# Altium project HomeButtons_mini.PrjPcb
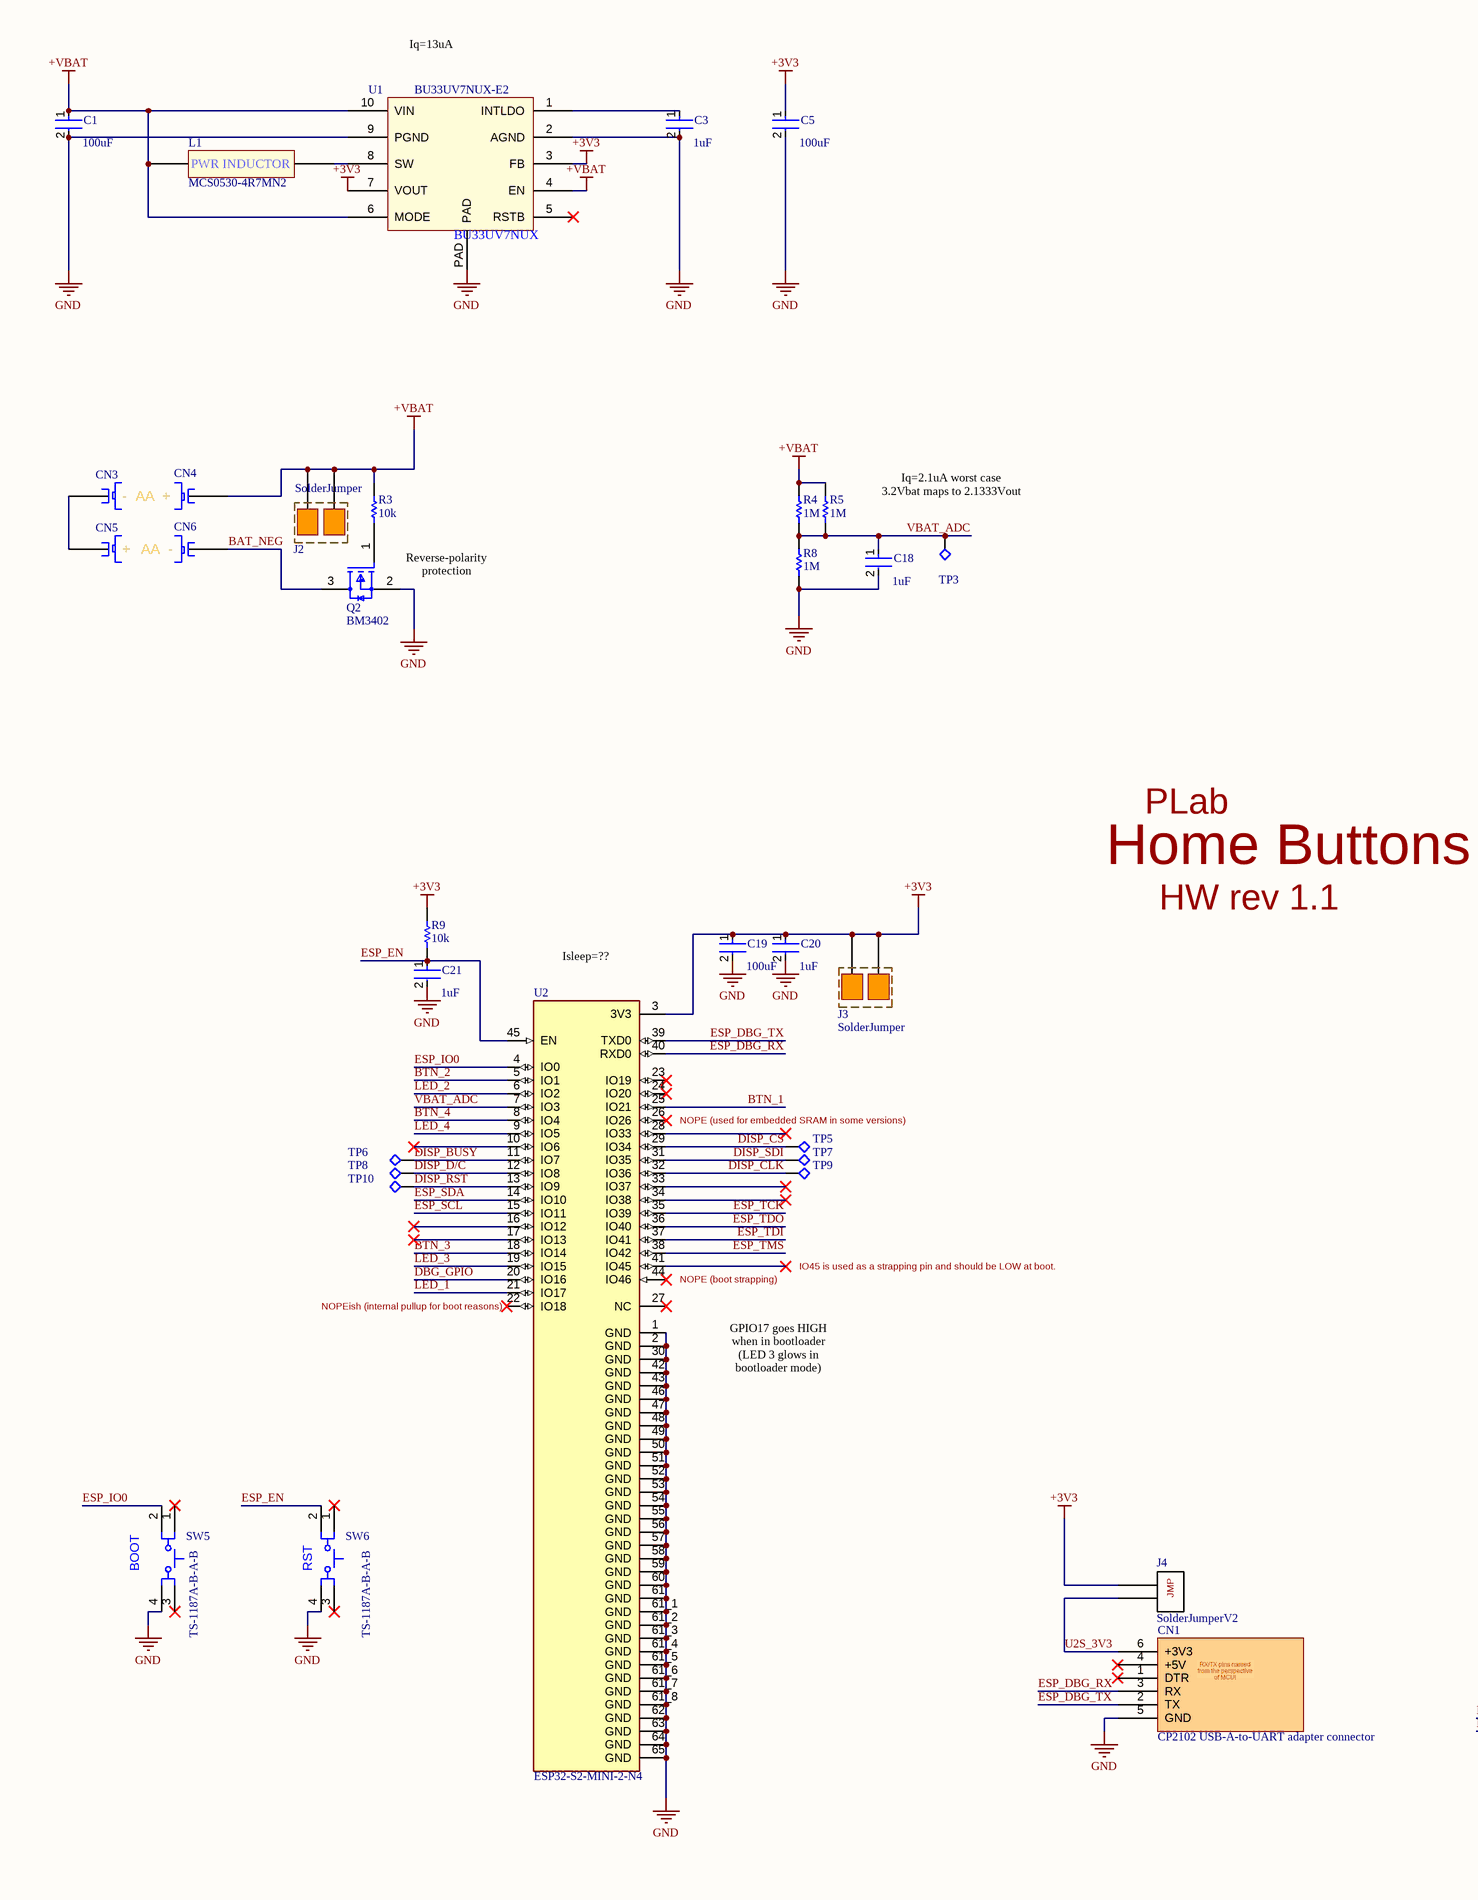
[diagram p0: HB_mini_schematic.SchDoc, left]
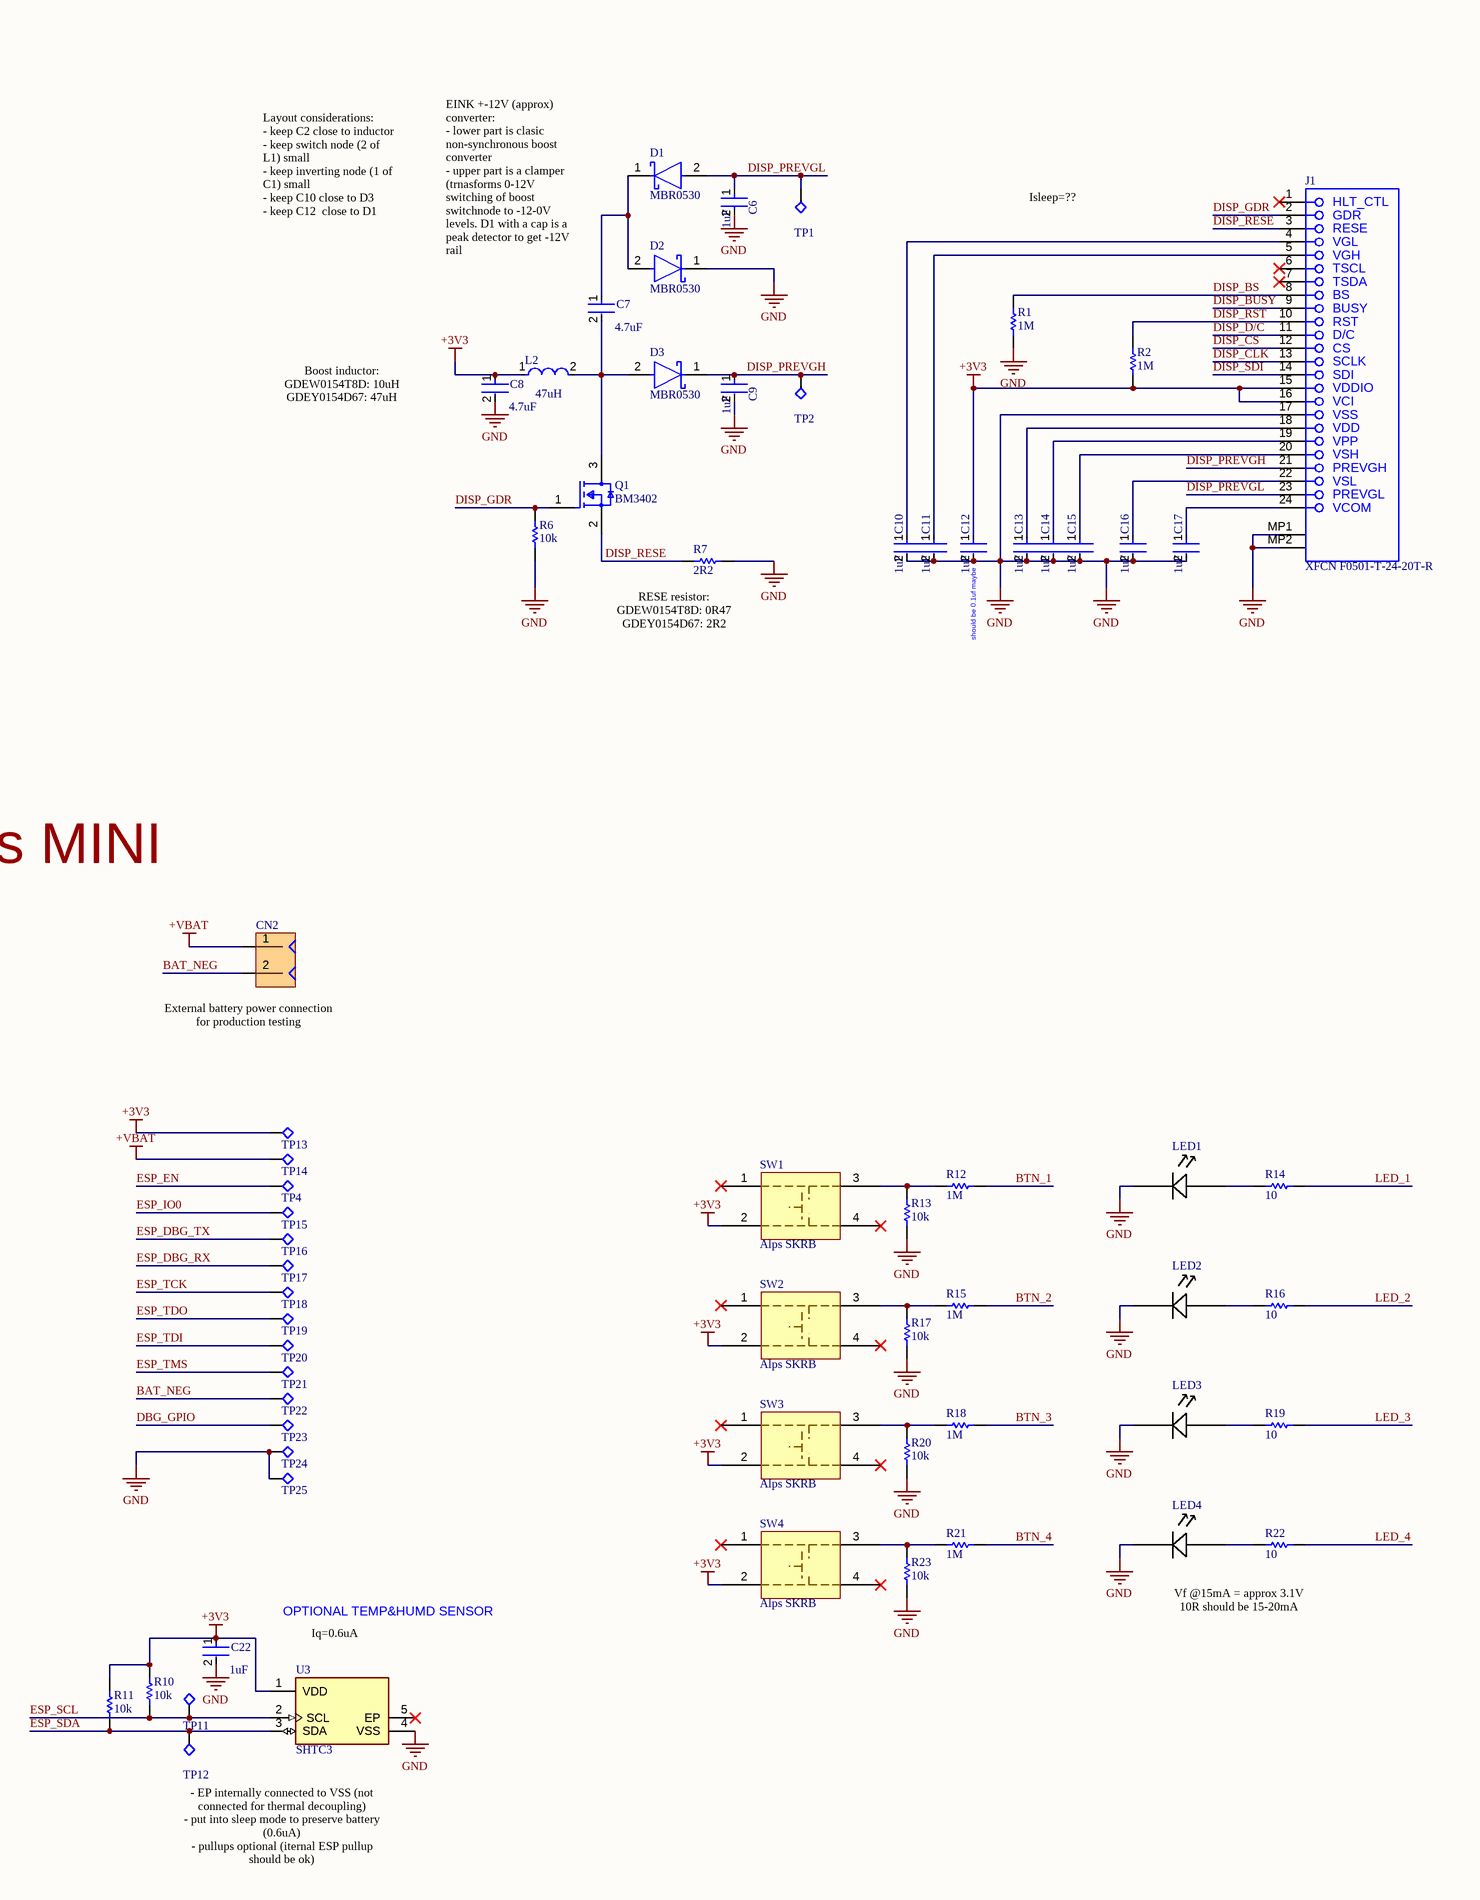
[diagram p1: HB_mini_schematic.SchDoc, right]
1 sheet, 98 parts. Net scope: global (net labels, ports and power ports of the same name join across sheets).
Board files: HB_mini_alt_PCB.PcbDoc, HB_mini_panel.PcbDoc

## Sheet HB_mini_schematic.SchDoc
size 594 x 420 mm; SheetNumber: 1; SheetTotal: 1

### Parts
C1  Capacitance: 100uF  [FP-CL31-IPC_B]  (hidden comment: CL31A107MQHNNNE)
C3  value 1uF  [FP-CL10B105KO8NNNC-IPC_B]  (hidden comment: CL10A105KB8NNNC)
C5  Capacitance: 100uF  [FP-CL31-IPC_B]  (hidden comment: CL31A107MQHNNNE)
C6  value 1uF  [FP-CL10B105KO8NNNC-IPC_B]  (hidden comment: CL10A105KB8NNNC)
C7  Capacitance: 4.7uF  [FP-CL21-IPC_A]  (hidden comment: CL21A475KAQNNNE)
C8  Capacitance: 4.7uF  [FP-CL21-IPC_A]  (hidden comment: CL21A475KAQNNNE)
C9  value 1uF  [FP-CL10B105KO8NNNC-IPC_B]  (hidden comment: CL10A105KB8NNNC)
C10  value 1uF  [FP-CL10B105KO8NNNC-IPC_B]  (hidden comment: CL10A105KB8NNNC)
C11  value 1uF  [FP-CL10B105KO8NNNC-IPC_B]  (hidden comment: CL10A105KB8NNNC)
C12  value 1uF  [FP-CL10B105KO8NNNC-IPC_B]  (hidden comment: CL10A105KB8NNNC)
C13  value 1uF  [FP-CL10B105KO8NNNC-IPC_B]  (hidden comment: CL10A105KB8NNNC)
C14  value 1uF  [FP-CL10B105KO8NNNC-IPC_B]  (hidden comment: CL10A105KB8NNNC)
C15  value 1uF  [FP-CL10B105KO8NNNC-IPC_B]  (hidden comment: CL10A105KB8NNNC)
C16  value 1uF  [FP-CL10B105KO8NNNC-IPC_B]  (hidden comment: CL10A105KB8NNNC)
C17  value 1uF  [FP-CL10B105KO8NNNC-IPC_B]  (hidden comment: CL10A105KB8NNNC)
C18  value 1uF  [FP-CL10B105KO8NNNC-IPC_B]  (hidden comment: CL10A105KB8NNNC)
C19  Capacitance: 100uF  [FP-CL31-IPC_B]  (hidden comment: CL31A107MQHNNNE)
C20  value 1uF  [FP-CL10B105KO8NNNC-IPC_B]  (hidden comment: CL10A105KB8NNNC)
C21  value 1uF  [FP-CL10B105KO8NNNC-IPC_B]  (hidden comment: CL10A105KB8NNNC)
C22  value 1uF  [FP-CL10B105KO8NNNC-IPC_B]  (hidden comment: CL10A105KB8NNNC)
CN1  CP2102 USB-A-to-UART adapter connector  [CP2102 USB-A-to-UART adapter connector]
CN2  2 pin pogo connection  [2x2 POGO power landing pad]  (value not drawn)
CN3  Battery contact  [MYOUNG MY-AA-04]  (value not drawn)
CN4  Battery contact  [MYOUNG MY-AA-04]  (value not drawn)
CN5  Battery contact  [MYOUNG MY-AA-04]  (value not drawn)
CN6  Battery contact  [MYOUNG MY-AA-04]  (value not drawn)
D1  MBR0530  [FP-425-04-IPC_B]
D2  MBR0530  [FP-425-04-IPC_B]
D3  MBR0530  [FP-425-04-IPC_B]
J1  XFCN F0501-T-24-20T-R  [XFCN F0501-T-24-20T-R]
J2  SolderJumper  [AislerRule_SolderJumper_1mm]
J3  SolderJumper  [AislerRule_SolderJumper_1mm]
J4  SolderJumperV2  [AislerRule_SolderJumper_1mm]
L1  MCS0530-4R7MN2  [MCS0530-4R7MN2 - NEW]
L2  Inductance: 47uH  [FP-CB3225-IPC_B]  (hidden comment: CBC3225T470KR)
LED1  EKINGLUX E6CC1206CWAY1UDA  [EKINGLUX E6CC1206CWAY1UDA]  (value not drawn)
LED2  EKINGLUX E6CC1206CWAY1UDA  [EKINGLUX E6CC1206CWAY1UDA]  (value not drawn)
LED3  EKINGLUX E6CC1206CWAY1UDA  [EKINGLUX E6CC1206CWAY1UDA]  (value not drawn)
LED4  EKINGLUX E6CC1206CWAY1UDA  [EKINGLUX E6CC1206CWAY1UDA]  (value not drawn)
Q1  BM3402  [FP-SOT23-IPC_B]
Q2  BM3402  [FP-SOT23-IPC_B]
R1  value 1M  [RESC1608X55X30NL15T15]  (hidden comment: 0603WAF1004T5E)
R2  value 1M  [RESC1608X55X30NL15T15]  (hidden comment: 0603WAF1004T5E)
R3  value 10k  [RESC1608X55X30NL15T15]  (hidden comment: 0603WAF1002T5E)
R4  value 1M  [RESC1608X55X30NL15T15]  (hidden comment: 0603WAF1004T5E)
R5  value 1M  [RESC1608X55X30NL15T15]  (hidden comment: 0603WAF1004T5E)
R6  value 10k  [RESC1608X55X30NL15T15]  (hidden comment: 0603WAF1002T5E)
R7  value 2R2  [RESC1608X55X30ML15T15]  (hidden comment: 0603WAF220KT5E)
R8  value 1M  [RESC1608X55X30NL15T15]  (hidden comment: 0603WAF1004T5E)
R9  value 10k  [RESC1608X55X30NL15T15]  (hidden comment: 0603WAF1002T5E)
R10  value 10k  [RESC1608X55X30NL15T15]  (hidden comment: 0603WAF1002T5E)
R11  value 10k  [RESC1608X55X30NL15T15]  (hidden comment: 0603WAF1002T5E)
R12  value 1M  [RESC1608X55X30NL15T15]  (hidden comment: 0603WAF1004T5E)
R13  value 10k  [RESC1608X55X30NL15T15]  (hidden comment: 0603WAF1002T5E)
R14  value 10  [RESC1608X55X30NL15T15]  (hidden comment: 0603WAF100JT5E)
R15  value 1M  [RESC1608X55X30NL15T15]  (hidden comment: 0603WAF1004T5E)
R16  value 10  [RESC1608X55X30NL15T15]  (hidden comment: 0603WAF100JT5E)
R17  value 10k  [RESC1608X55X30NL15T15]  (hidden comment: 0603WAF1002T5E)
R18  value 1M  [RESC1608X55X30NL15T15]  (hidden comment: 0603WAF1004T5E)
R19  value 10  [RESC1608X55X30NL15T15]  (hidden comment: 0603WAF100JT5E)
R20  value 10k  [RESC1608X55X30NL15T15]  (hidden comment: 0603WAF1002T5E)
R21  value 1M  [RESC1608X55X30NL15T15]  (hidden comment: 0603WAF1004T5E)
R22  value 10  [RESC1608X55X30NL15T15]  (hidden comment: 0603WAF100JT5E)
R23  value 10k  [RESC1608X55X30NL15T15]  (hidden comment: 0603WAF1002T5E)
SW1  Alps SKRB  [Alps SKRB]
SW2  Alps SKRB  [Alps SKRB]
SW3  Alps SKRB  [Alps SKRB]
SW4  Alps SKRB  [Alps SKRB]
SW5  TS-1187A-B-A-B  [ESWI-TL3342F160QG_V]
SW6  TS-1187A-B-A-B  [ESWI-TL3342F160QG_V]
TP1  test point 1.5mm  [TP1_FULL]  (value not drawn)
TP2  test point 1.5mm  [TP1_FULL]  (value not drawn)
TP3  test point 1.5mm  [TP1_FULL]  (value not drawn)
TP4  test point 1.5mm  [TP1_FULL]  (value not drawn)
TP5  test point 1.5mm  [TP1_FULL]  (value not drawn)
TP6  test point 1.5mm  [TP1_FULL]  (value not drawn)
TP7  test point 1.5mm  [TP1_FULL]  (value not drawn)
TP8  test point 1.5mm  [TP1_FULL]  (value not drawn)
TP9  test point 1.5mm  [TP1_FULL]  (value not drawn)
TP10  test point 1.5mm  [TP1_FULL]  (value not drawn)
TP11  test point 1.5mm  [TP1_FULL]  (value not drawn)
TP12  test point 1.5mm  [TP1_FULL]  (value not drawn)
TP13  test point 1.5mm  [TP1_FULL]  (value not drawn)
TP14  test point 1.5mm  [TP1_FULL]  (value not drawn)
TP15  test point 1.5mm  [TP1_FULL]  (value not drawn)
TP16  test point 1.5mm  [TP1_FULL]  (value not drawn)
TP17  test point 1.5mm  [TP1_FULL]  (value not drawn)
TP18  test point 1.5mm  [TP1_FULL]  (value not drawn)
TP19  test point 1.5mm  [TP1_FULL]  (value not drawn)
TP20  test point 1.5mm  [TP1_FULL]  (value not drawn)
TP21  test point 1.5mm  [TP1_FULL]  (value not drawn)
TP22  test point 1.5mm  [TP1_FULL]  (value not drawn)
TP23  test point 1.5mm  [TP1_FULL]  (value not drawn)
TP24  test point 1.5mm  [TP1_FULL]  (value not drawn)
TP25  test point 1.5mm  [TP1_FULL]  (value not drawn)
U1  BU33UV7NUX-E2  [VSON010X3020]
U2  ESP32-S2-MINI-2-N4  [XCVR_ESP32-S2-MINI-1]
U3  SHTC3  [FP-SHTC3-MFG]

### Nets
+3V3: C5.1 C8.1 C12.1 C19.1 C20.1 C22.1 J1.15 J1.16 J3.1 J3.2 J4.1(P1) L2.1 R2.1 R9.2 R10.2 R11.2 SW1.2 SW2.2 SW3.2 SW4.2 TP13.1 U1.3(FB) U1.7(VOUT) U2.3(3V3) U3.1(VDD)
+VBAT: C1.1 CN2.1 CN4.1 J2.1 J2.2 L1.1 R3.2 R4.2 R5.2 TP14.1 U1.4(EN) U1.6(MODE) U1.10(VIN)
GND: C1.2 C3.2 C5.2 C6.2 C8.2 C9.2 C10.2 C11.2 C12.2 C13.2 C14.2 C15.2 C16.2 C17.2 C18.2 C19.2 C20.2 C21.2 C22.2 CN1.5(GND) D2.1(C) J1.17 J1.MP1 J1.MP2 LED1.2(NEG) LED2.2(NEG) LED3.2(NEG) LED4.2(NEG) Q2.2(S) R1.1 R6.1 R7.2 R8.1 R13.1 R17.1 R20.1 R23.1 SW5.4 SW6.4 TP24.1 TP25.1 U1.2(AGND) U1.9(PGND) U1.PAD U2.1(GND) U2.2(GND) U2.30(GND) U2.42(GND) U2.43(GND) U2.46(GND) U2.47(GND) U2.48(GND) U2.49(GND) U2.50(GND) U2.51(GND) U2.52(GND) U2.53(GND) U2.54(GND) U2.55(GND) U2.56(GND) U2.57(GND) U2.58(GND) U2.59(GND) U2.60(GND) U2.61(GND) U2.61_1(GND) U2.61_2(GND) U2.61_3(GND) U2.61_4(GND) U2.61_5(GND) U2.61_6(GND) U2.61_7(GND) U2.61_8(GND) U2.62(GND) U2.63(GND) U2.64(GND) U2.65(GND) U3.4(VSS)
BAT_NEG: CN2.2 CN6.1 Q2.3(D) TP22.1
BTN_1: R12.2 U2.25(IO21)
BTN_2: R15.2 U2.5(IO1)
BTN_3: R18.2 U2.18(IO14)
BTN_4: R21.2 U2.8(IO4)
DBG_GPIO: TP23.1 U2.20(IO16)
DISP_BS: J1.8 R1.2
DISP_BUSY: J1.9 TP6.1 U2.11(IO7)
DISP_CLK: J1.13 TP9.1 U2.32(IO36)
DISP_CS: J1.12 TP5.1 U2.29(IO34)
DISP_D/C: J1.11 TP8.1 U2.12(IO8)
DISP_GDR: J1.2 Q1.1(G) R6.2
DISP_PREVGH: C9.1 D3.1(C) J1.21 TP2.1
DISP_PREVGL: C6.1 D1.2(A) J1.23 TP1.1
DISP_RESE: J1.3 Q1.2(S) R7.1
DISP_RST: J1.10 R2.2 TP10.1 U2.13(IO9)
DISP_SDI: J1.14 TP7.1 U2.31(IO35)
ESP_DBG_RX: CN1.3(RX) TP17.1 U2.40(RXD0)
ESP_DBG_TX: CN1.2(TX) TP16.1 U2.39(TXD0)
ESP_EN: C21.1 R9.1 SW6.2 TP4.1 U2.45(EN)
ESP_IO0: SW5.2 TP15.1 U2.4(IO0)
ESP_SCL: R10.1 TP11.1 U2.15(IO11) U3.2(SCL)
ESP_SDA: R11.1 TP12.1 U2.14(IO10) U3.3(SDA)
ESP_TCK: TP18.1 U2.35(IO39)
ESP_TDI: TP20.1 U2.37(IO41)
ESP_TDO: TP19.1 U2.36(IO40)
ESP_TMS: TP21.1 U2.38(IO42)
LED_1: R14.1 U2.21(IO17)
LED_2: R16.1 U2.6(IO2)
LED_3: R19.1 U2.19(IO15)
LED_4: R22.1 U2.9(IO5)
U2S_3V3: CN1.6(+3V3) J4.2
VBAT_ADC: C18.1 R4.1 R5.1 R8.2 TP3.1 U2.7(IO3)
NetC3_1: C3.1 U1.1(INTLDO)
NetC7_1: C7.1 D1.1(C) D2.2(A)
NetC7_2: C7.2 D3.2(A) L2.2 Q1.3(D)
NetC10_1: C10.1 J1.4
NetC11_1: C11.1 J1.5
NetC13_1: C13.1 J1.18
NetC14_1: C14.1 J1.19
NetC15_1: C15.1 J1.20
NetC16_1: C16.1 J1.22
NetC17_1: C17.1 J1.24
NetCN3_1: CN3.1 CN5.1
NetL1_2: L1.2 U1.8(SW)
NetLED1_1: LED1.1(POS) R14.2
NetLED2_1: LED2.1(POS) R16.2
NetLED3_1: LED3.1(POS) R19.2
NetLED4_1: LED4.1(POS) R22.2
NetQ2_1: Q2.1(G) R3.1
NetR12_1: R12.1 R13.2 SW1.3
NetR15_1: R15.1 R17.2 SW2.3
NetR18_1: R18.1 R20.2 SW3.3
NetR21_1: R21.1 R23.2 SW4.3

Not connected (* = marked no-connect by the designer): CN1 1(DTR)* 4(+5V)*; J1 1* 6* 7*; SW1 1* 4*; SW2 1* 4*; SW3 1* 4*; SW4 1* 4*; SW5 1* 3*; SW6 1* 3*; U1 5(RSTB)*; U2 10(IO6)* 16(IO12)* 17(IO13)* 22(IO18)* 23(IO19)* 24(IO20)* 26(IO26)* 27(NC)* 28(IO33)* 33(IO37)* 34(IO38)* 41(IO45)* 44(IO46)*; U3 5(EP)*

### Notes on the sheet
- (near U1) Iq=13uA
- Isleep=??
- Layout considerations:
  - keep C2 close to inductor
  - keep switch node (2 of L1) small
  - keep inverting node (1 of C1) small
  - keep C10 close to D3
  - keep C12  close to D1
- EINK +-12V (approx) converter:
  - lower part is clasic non-synchronous boost converter
  - upper part is a clamper (trnasforms 0-12V switching of boost switchnode to -12-0V levels. D1 with a cap is a peak detector to get -12V rail
- Boost inductor:
  GDEW0154T8D: 10uH
  GDEY0154D67: 47uH
- (near CN5) +
- (near CN3) -
- AA
- (near CN4) +
- (near CN6) -
- Iq=2.1uA worst case
  3.2Vbat maps to 2.1333Vout
- (near Q2) Reverse-polarity protection
- (near R7) RESE resistor:
  GDEW0154T8D: 0R47
  GDEY0154D67: 2R2
- (near C12) should be 0.1uf maybe
- PLab
- Home Buttons MINI
- HW rev 1.1
- (near U2) Isleep=??
- (near CN2) External battery power connection for production testing
- NOPE (used for embedded SRAM in some versions)
- (near U2) NOPE (boot strapping)
- IO45 is used as a strapping pin and should be LOW at boot.
- (near U2) NOPEish (internal pullup for boot reasons)
- GPIO17 goes HIGH when in bootloader (LED 3 glows in bootloader mode)
- (near SW5) BOOT
- (near SW6) RST
- OPTIONAL TEMP&HUMD SENSOR
- (near U3) Iq=0.6uA
- Vf @15mA = approx 3.1V
  10R should be 15-20mA
- - EP internally connected to VSS (not connected for thermal decoupling)
  - put into sleep mode to preserve battery (0.6uA)
  - pullups optional (iternal ESP pullup should be ok)
- DWG NO:
- REV:
- THIS DOCUMENT AND THE DATA DISCLOSED HEREIN OR
- HEREWITH IS THE PROPERTY OF ALTIUM LIMITED AND MAY
- BE FREELY DISTRIBUTED IN WHOLE. NO RIGHTS ARE
- RESERVED OR EXPRESS OR IMPLIED WARANTEE GIVEN.
- REVISION
- DESCRIPTION
- DATE
- APPROVED
- ENG:
- APPROVALS
- PROJECT
- DSN:
- CHK:
- REFERENCE DOCUMENTS
- PROJECT REVISION:
- TITLE
- DOCUMENT REVISION:
- DESIGN ITEM:
- BOM:
- FAB DWG:
- PCB DWG:
- ASSY DWG:
- SCALE:
- A2
- SIZE
- CAGE CODE
- FILE NAME
- DWG NO.
- SHEET
- OF
- REV
- (in symbol BU33UV7NUX-E2) BU33UV7NUX
- (in symbol CP2102 USB-A-to-UART adapter connector) RX/TX pins named from the perspective of MCU!
- (in symbol PowerInductor) PWR INDUCTOR
- (in symbol SolderJumperV2) JMP
- (in symbol XFCN F0501-T-24-20T-R) HLT_CTL; GDR; RESE; VGL; VGH; TSCL; TSDA; BS; BUSY; RST; D/C; CS; SCLK; SDI; VDDIO; VCI; VSS; VDD; VPP; VSH; PREVGH; VSL; PREVGL; VCOM

### Library data of the parts
C1 C5 C19 = CMP-13271-002604-1: Cap Ceramic 100uF 6.3V X5R ±10% SMD 1206; Package Quantity: 1; Radiation Hardening: No; Thickness: 0.071inch; Case Code (Metric): 3216; Height: 1.6mm; Min Operating Temperature: -55°C; Width: 0.063inch; Mount: Surface Mount; Packaging: Tape and Reel; Depth: 1.6mm; Max Operating Temperature: 85°C; Dielectric: X5R; Case/Package: 1206; Lead Free: Lead Free; Tolerance: 10%; Case Code (Imperial): 1206; Length: 3.2mm; Voltage Rating (DC): 6.3V; Voltage Rating: 6.3V; JLCPCB part #: C15008
C3 C6 C9-C18 C20-C22 = CMP-2000-06093-2: CAP CER 1UF 50V X5R 0603; Manufacturer: Samsung Electro-Mechanics America, Inc; Manufacturer Part Number: CL10B105KO8NNNC; Temperature Coefficient: 15%; Material: Ceramic; Tolerance: 10%; Voltage Rating: 50V; Automotive: No; ComponentLink2Description: Datasheet; Device Class L3: Ceramic Capacitors; Capacitance: 1uF; Temperature Characteristic: X5R; Temperature Range High: +125°C; Digikey Description: CAP CER 1UF 16V X7R 0603; Device Class L2: Capacitors; Octopart: https://octopart.com/cl10b105ko8nnnc-samsung-19018973; ComponentLink2URL: http://www.samsungsem.com/global/front/downloadcms.do?path=%2F%2Fglobal%2F%2Fsupport%2F%2Fproduct-search%2F%2Fmlcc%2F%2F__icsFiles%2F%2Fafieldfile%2F%2F2019%2F%2F06%2F%2F18&fileName=CL10B105KO8NNNC-19.pdf; Lead Free: Yes; Height: 0.9mm; Package: CL10B105KO8NNNC; Temperature Range Low: -55°C; Device Class L1: Passive Components; RoHS: TRUE; Temperature: -55°C to +125°C; Category: Cap; Ipc Land Pattern Name: CAPC16080X80; JLCPCB part #: C15849
C7 C8 = CMP-13271-002624-1: CL21 Series 0805 4.7uF 25V ±10% Tolerance X5R Multilayer Ceramic Chip Capacitor; Case Code (Imperial): 0805; Thickness: 0.055inch; Mount: Surface Mount; Case Code (Metric): 2012; Depth: 1.25mm; Lead Free: Lead Free; Case/Package: 0805; Voltage Rating: 25V; Package Quantity: 1; Width: 0.049inch; Radiation Hardening: No; Voltage Rating (DC): 25V; Length: 2mm; Dielectric: X5R; Height: 1.25mm; Packaging: Tape and Reel; Tolerance: 10%; Min Operating Temperature: -55°C; Max Operating Temperature: 85°C; JLCPCB part #: C1779
CN3-CN6 = Battery contact: Battery contact with selectable footprint; JLCPCB part #: C2979179
D1-D3 = CMP-2000-05113-2: DIODE SCHOTTKY 30V 500MA SOD123; Polarity: Standard; Max Reverse Leakage Current: 130uA; Forward Voltage: 430mV; Element Configuration: Single; Peak Non-Repetitive Surge Current: 5.5A; REACH SVHC: No SVHC; Contact Plating: Tin; Width: 1.6mm; Weight: 0.03g; Max Reverse Voltage (DC): 30V; Mount: Surface Mount; Max Repetitive Reverse Voltage (Vrrm): 30V; Number of Pins: 2; Height: 1.03mm; Current Rating: 500mA; Max Forward Surge Current (Ifsm): 5.5A; Lead Free: Lead Free; Max Surge Current: 5.5A; Peak Reverse Current: 130uA; Min Operating Temperature: -65°C; Radiation Hardening: No; Max Operating Temperature: 150°C; Average Rectified Current: 500mA; Packaging: Tape and Reel; Length: 2.7mm; Forward Current: 500mA; Voltage Rating (DC): 30V; Package Quantity: 1; Output Current: 500mA; JLCPCB part #: C77336
J1 = XFCN F0501-T-24-20T-R: XFCN F0501-T-24-20T-R 0.5mm fpc top contacts, slide retentioner; JLCPCB part #: C840496
L1 = PowerInductor: SMD Power inductio, selectable footprint; ComponentLink1Description: Datasheet; ComponentLink1URL: *; JLCPCB part #: C2836880
L2 = CMP-14484-000388-1: SMD Inductors 47uH ±10% 0.48A 0.871Ω 1210; Max DC Current: 480mA; DC Resistance (DCR): 871mR; Core Material: Ferrite; Shielding: Unshielded; Test Frequency: 100kHz; Self Resonant Frequency: 10MHz; Saturation Current: 390mA; Inductance Tolerance: 10%; Package Quantity: 1000; Current Rating: 480mA; DC Current: 480mA; Halogen Free: Halogen Free; Depth: 2.7mm; Case Code (Metric): 3225; Lead Free: Lead Free; Height: 2.5mm; Width: 0.098inch; RoHS Compliant: Yes; Tolerance: 10%; Mount: Surface Mount; Radiation Hardening: No; Case Code (Imperial): 1210; Max Operating Temperature: 105°C; Height - Seated (Max): 0.106inch; Min Operating Temperature: -40°C; Length: 0.126inch; Packaging: Tape and Reel; Military Standard: Not; Series: CB; Termination: SMD/SMT; Case/Package: 1210; Resistor Type: Wirewound; JLCPCB part #: C90318
LED1-LED4 = Everlight Elec 23-21B/T1D-CP2Q2TY/2A: reverse mount SMD led, cool white; JLCPCB part #: C375565
Q1 Q2 = CMP-83955-000006-1: BORN BM3402 MOSFET N-CH 30V 5.1A SOT23; JLCPCB part #: C431498
R1 R2 R4 R5 R8 R12 R15 R18 R21 = CMP-1012-00849-2: Manufacturer: Panasonic; Part Number: 0603WAF1004T5E; JLCPCB part #: C22935
R3 R6 R9-R11 R13 R14 R16 R17 R19 R20 R22 R23 = CMP-2000-00540-1: Manufacturer: UNI_ROYAL
  R3 R6 R9-R11 R13 R17 R20 R23: Part Number: 0603WAF1002T5E; JLCPCB part #: C25804
  R14 R16 R19 R22: Part Number: 0603WAF100JT5E; JLCPCB part #: C22859
R7 = CMP-2000-00787-1: Manufacturer: UNI-ROYAL; Part Number: 0603WAF220KT5E; JLCPCB part #: C22939
SW1-SW4 = Alps SKRB: SKRB series SMD tactile button Alps Alpine; Variant: SKRBAKE010; JLCPCB part #: C139790; ComponentLink1Description: Datasheet; ComponentLink1URL: https://tech.alpsalpine.com/prod/e/html/tact/surfacemount/skrb/skrbake010.html
SW5 SW6 = CMP-1696-00003-1: XKB TS-1187A-B-A-B C318884; JLCPCB part #: C318884
TP1-TP25 = Test Point: Test point ,1.5mm diameter, no hole; Category: testpoints
U1 = BU33UV7NUX-E2: synchronous boost convertor with low / power consumption and provides a power supply for / products powered by either two-cell alkaline/NiCd/NiMH / or one-cell alkaline/Li-ion or Li-polymer battery. / Output currents can go as high as 500mA(VIN=1.8V); ComponentLink1Description: Datasheet; ComponentLink1URL: https://eu.mouser.com/datasheet/2/348/bu33uv7nux-e-1874391.pdf; JLCPCB part #: C181966
U2 = ESP32-S2-MINI-1: WiFi 802.11b/g/n Transceiver Module 2.412GHz ~ 2.484GHz Antenna Not Included Surface Mount; MF: Espressif Systems; SnapEDA_Link: https://www.snapeda.com/parts/ESP32-S2-MINI-1/Espressif+Systems/view-part/?ref=snap; MP: ESP32-S2-MINI-1; Price: None; Package: NON STANDARD-65 Espressif Systems; Value: *; Check_prices: https://www.snapeda.com/parts/ESP32-S2-MINI-1/Espressif+Systems/view-part/?ref=eda; Purchase-URL: https://pricing.snapeda.com/search/part/ESP32-S2-MINI-1/?ref=eda; Availability: In Stock; JLCPCB part #: C3013906
U3 = CMP-144040-000003-1: SENSOR HUMI/TEMP I2C 2% SMD; Manufacturer: Sensirion; Operating Supply Current: 0.3-900uA; Resolution: 16bits; Min Supply Voltage: 1.62V; Max Supply Voltage: 3.6V; Category: IC; Device Class L3: unset; ComponentLink2URL: https://www.sensirion.com/fileadmin/user_upload/customers/sensirion/Dokumente/0_Datasheets/Humidity/Sensirion_Humidity_Sensors_SHTC3_Datasheet.pdf; Ipc Land Pattern Name: DFN200X200X75-4; RoHS: TRUE; Height: 0.75mm; Interface: I2C; Temperature Range High: +125°C; Accuracy: 2%; Sensor Output: I2C; Automotive: No; Package: 0; Device Class L1: Sensors; Manufacturer Part Number: SHTC3; Digikey Description: SENSOR HUMI/TEMP I2C 2% SMD; Lead Free: Yes; Temperature: -40°C to +125°C; Device Class L2: Temperature and Humidity Sensors; ComponentLink2Description: Datasheet; Octopart: https://octopart.com/shtc3-sensirion-91912225; Mouser Description: SHTC3 Series 0 to 100% RH 3.6 V Humidity and Temperature Sensor IC - DFN-4; Temperature Range Low: -40°C; JLCPCB part #: C2880044